# EAGLE design Controller_low_power_v1.0 (EAGLE 9.3.0)

## Sheet 1 of 2
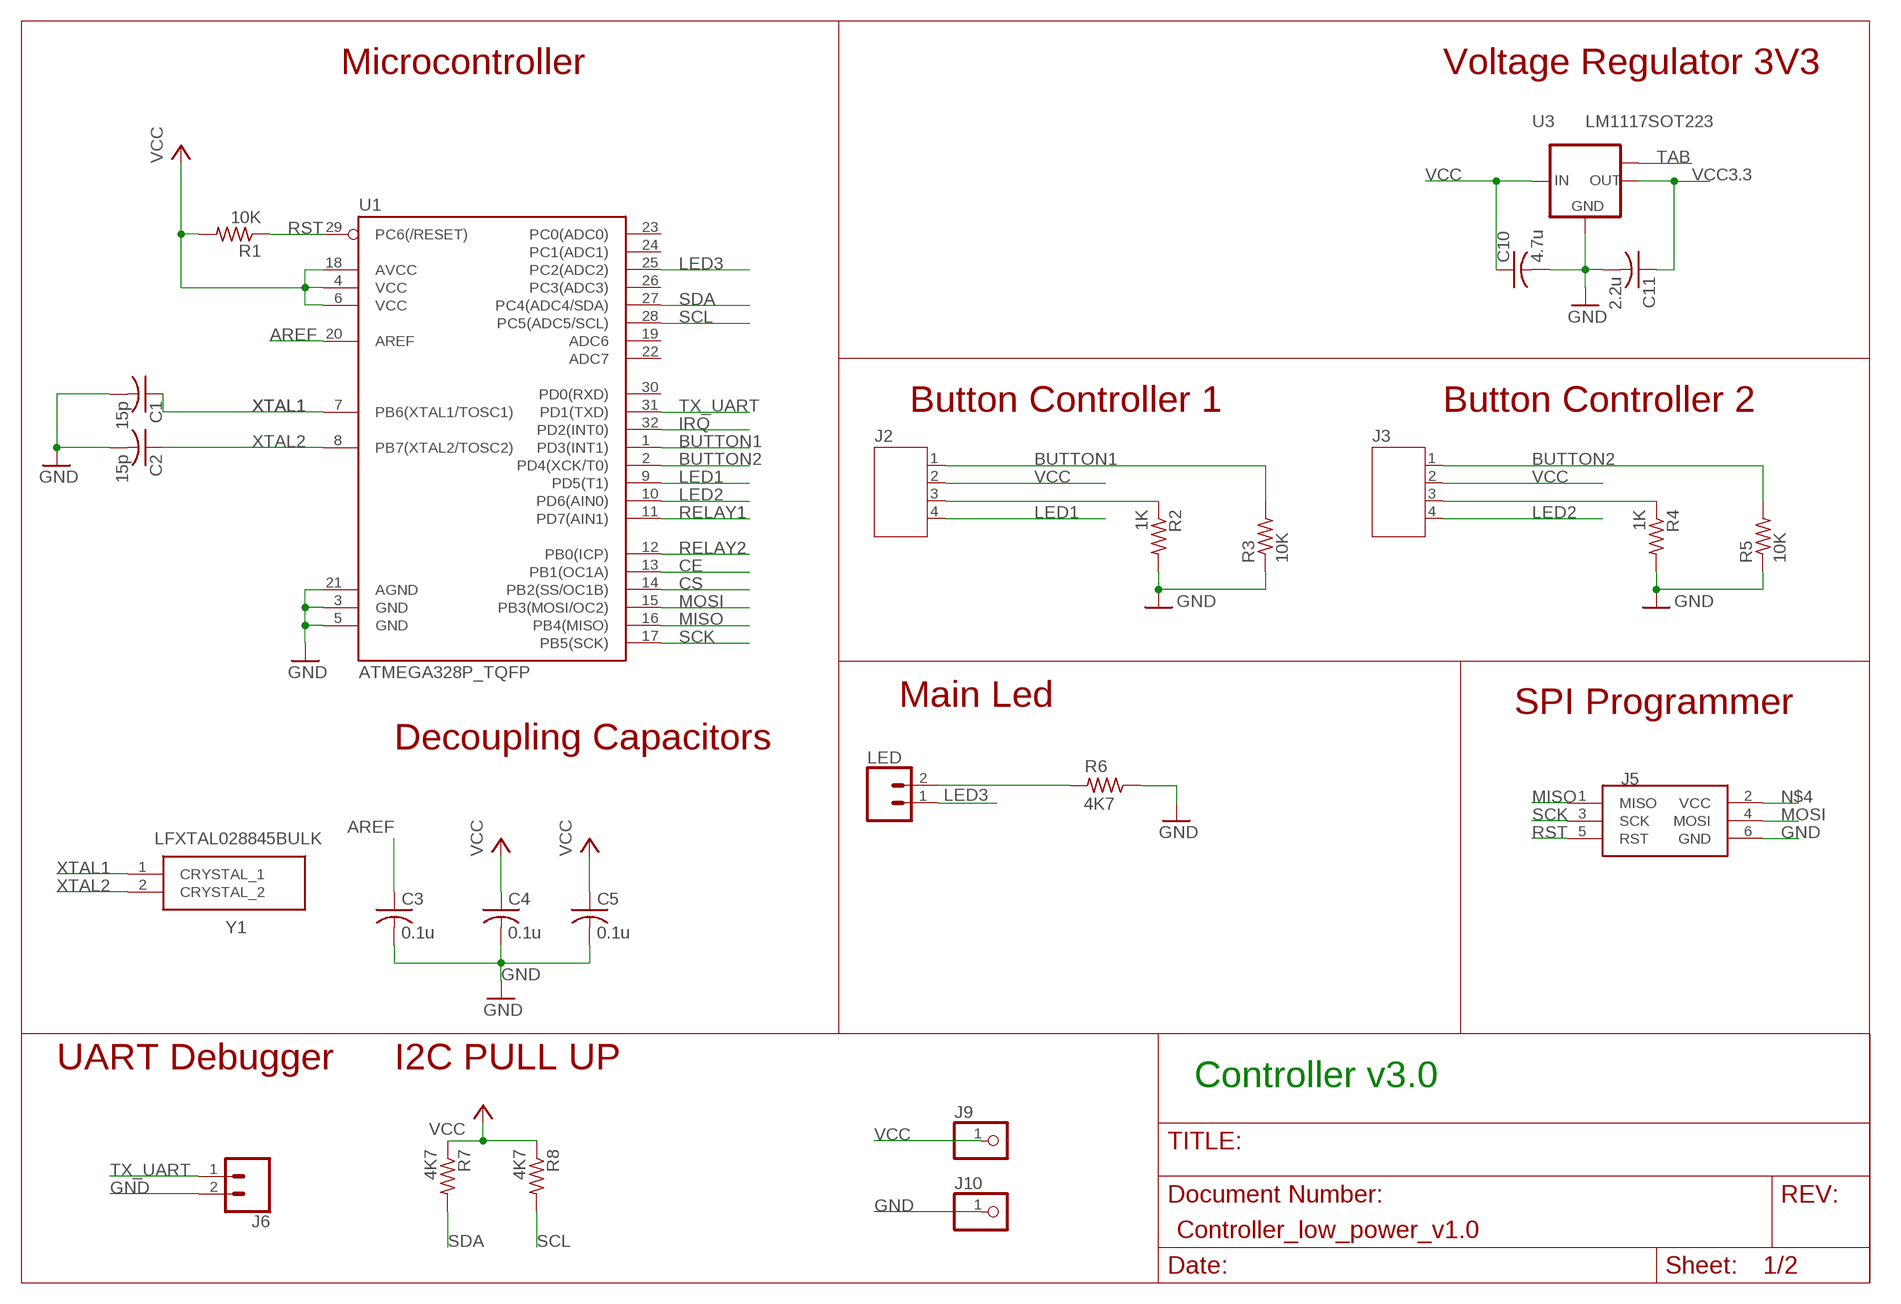
[diagram p0: schematic, sheet 1]

### Parts
C1  15p  CAPACITOR-SMD-0805  [SMD-0805]
C2  15p  CAPACITOR-SMD-0805  [SMD-0805]
C3  0.1u  CAPACITOR-SMD-0805  [SMD-0805]
C4  0.1u  CAPACITOR-SMD-0805  [SMD-0805]
C5  0.1u  CAPACITOR-SMD-0805  [SMD-0805]
C10  4.7u  CAPACITOR-SMD-0805  [SMD-0805]
C11  2.2u  CAPACITOR-SMD-0805  [SMD-0805]
J2  JST-PH4  [JST-PH4]
J3  JST-PH4  [JST-PH4]
J5  ISP  AVRISP-6  [AVRISP]
J6  CONN_02  [1X02]
J9  PINHD-1X1CB  [1X01-CLEANBIG]
J10  PINHD-1X1CB  [1X01-CLEANBIG]
LED  CONN_02  [1X02]
R1  10K  RESISTOR-SMD-0805  [SMD-0805]
R2  1K  RESISTOR-SMD-0805  [SMD-0805]
R3  10K  RESISTOR-SMD-0805  [SMD-0805]
R4  1K  RESISTOR-SMD-0805  [SMD-0805]
R5  10K  RESISTOR-SMD-0805  [SMD-0805]
R6  4K7  RESISTOR-SMD-0805  [SMD-0805]
R7  4K7  RESISTOR-SMD-0805  [SMD-0805]
R8  4K7  RESISTOR-SMD-0805  [SMD-0805]
U1  ATMEGA328P_TQFP  [TQFP32-08]
U3  LM1117SOT223  LM1117MPX-3.3  [SOT223]
Y1  LFXTAL028845BULK  [LFXTAL028845BULK]

### Nets
AREF: C3.1 U1.20(AREF)
BUTTON1: J2.1 R3.2 U1.1(PD3(INT1))
BUTTON2: J3.1 R5.2 U1.2(PD4(XCK/T0))
CE: U1.13(PB1(OC1A)) ; also sheet 2
CS: U1.14(PB2(SS/OC1B)) ; also sheet 2
GND: C1.2 C2.2 C3.2 C4.2 C5.2 C10.2 C11.2 J5.6(GND) J6.2 J10.1 R2.2 R3.1 R4.2 R5.1 R6.1 U1.3(GND) U1.5(GND) U1.21(AGND) U3.1(GND) ; also sheet 2
IRQ: U1.32(PD2(INT0)) ; also sheet 2
LED1: J2.4 U1.9(PD5(T1))
LED2: J3.4 U1.10(PD6(AIN0))
LED3: LED.1 U1.25(PC2(ADC2))
MISO: J5.1(MISO) U1.16(PB4(MISO)) ; also sheet 2
MOSI: J5.4(MOSI) U1.15(PB3(MOSI/OC2)) ; also sheet 2
N$4: J5.2(VCC)
N$8: LED.2 R6.2
N$9: J2.3 R2.1
N$11: J3.3 R4.1
RELAY1: U1.11(PD7(AIN1)) ; also sheet 2
RELAY2: U1.12(PB0(ICP)) ; also sheet 2
RST: J5.5(RST) R1.1 U1.29(PC6(/RESET))
SCK: J5.3(SCK) U1.17(PB5(SCK)) ; also sheet 2
SCL: R8.2 U1.28(PC5(ADC5/SCL)) ; also sheet 2
SDA: R7.2 U1.27(PC4(ADC4/SDA)) ; also sheet 2
TAB: U3.TAB(OUT1)
TX_UART: J6.1 U1.31(PD1(TXD))
VCC: C4.1 C5.1 C10.1 J2.2 J3.2 J9.1 R1.2 R7.1 R8.1 U1.4(VCC) U1.6(VCC) U1.18(AVCC) U3.3(IN) ; also sheet 2
VCC3.3: C11.1 U3.2(OUT) ; also sheet 2
XTAL1: C1.1 U1.7(PB6(XTAL1/TOSC1)) Y1.1(CRYSTAL_1)
XTAL2: C2.1 U1.8(PB7(XTAL2/TOSC2)) Y1.2(CRYSTAL_2)
Unconnected: U1.19(ADC6) U1.22(ADC7) U1.23(PC0(ADC0)) U1.24(PC1(ADC1)) U1.26(PC3(ADC3)) U1.30(PD0(RXD))

### Notes on the sheet
- Microcontroller | Voltage Regulator 3V3
- Button Controller 1 | Button Controller 2
- Main Led | SPI Programmer
- Decoupling Capacitors
- UART Debugger | I2C PULL UP
- Controller v3.0

## Sheet 2 of 2
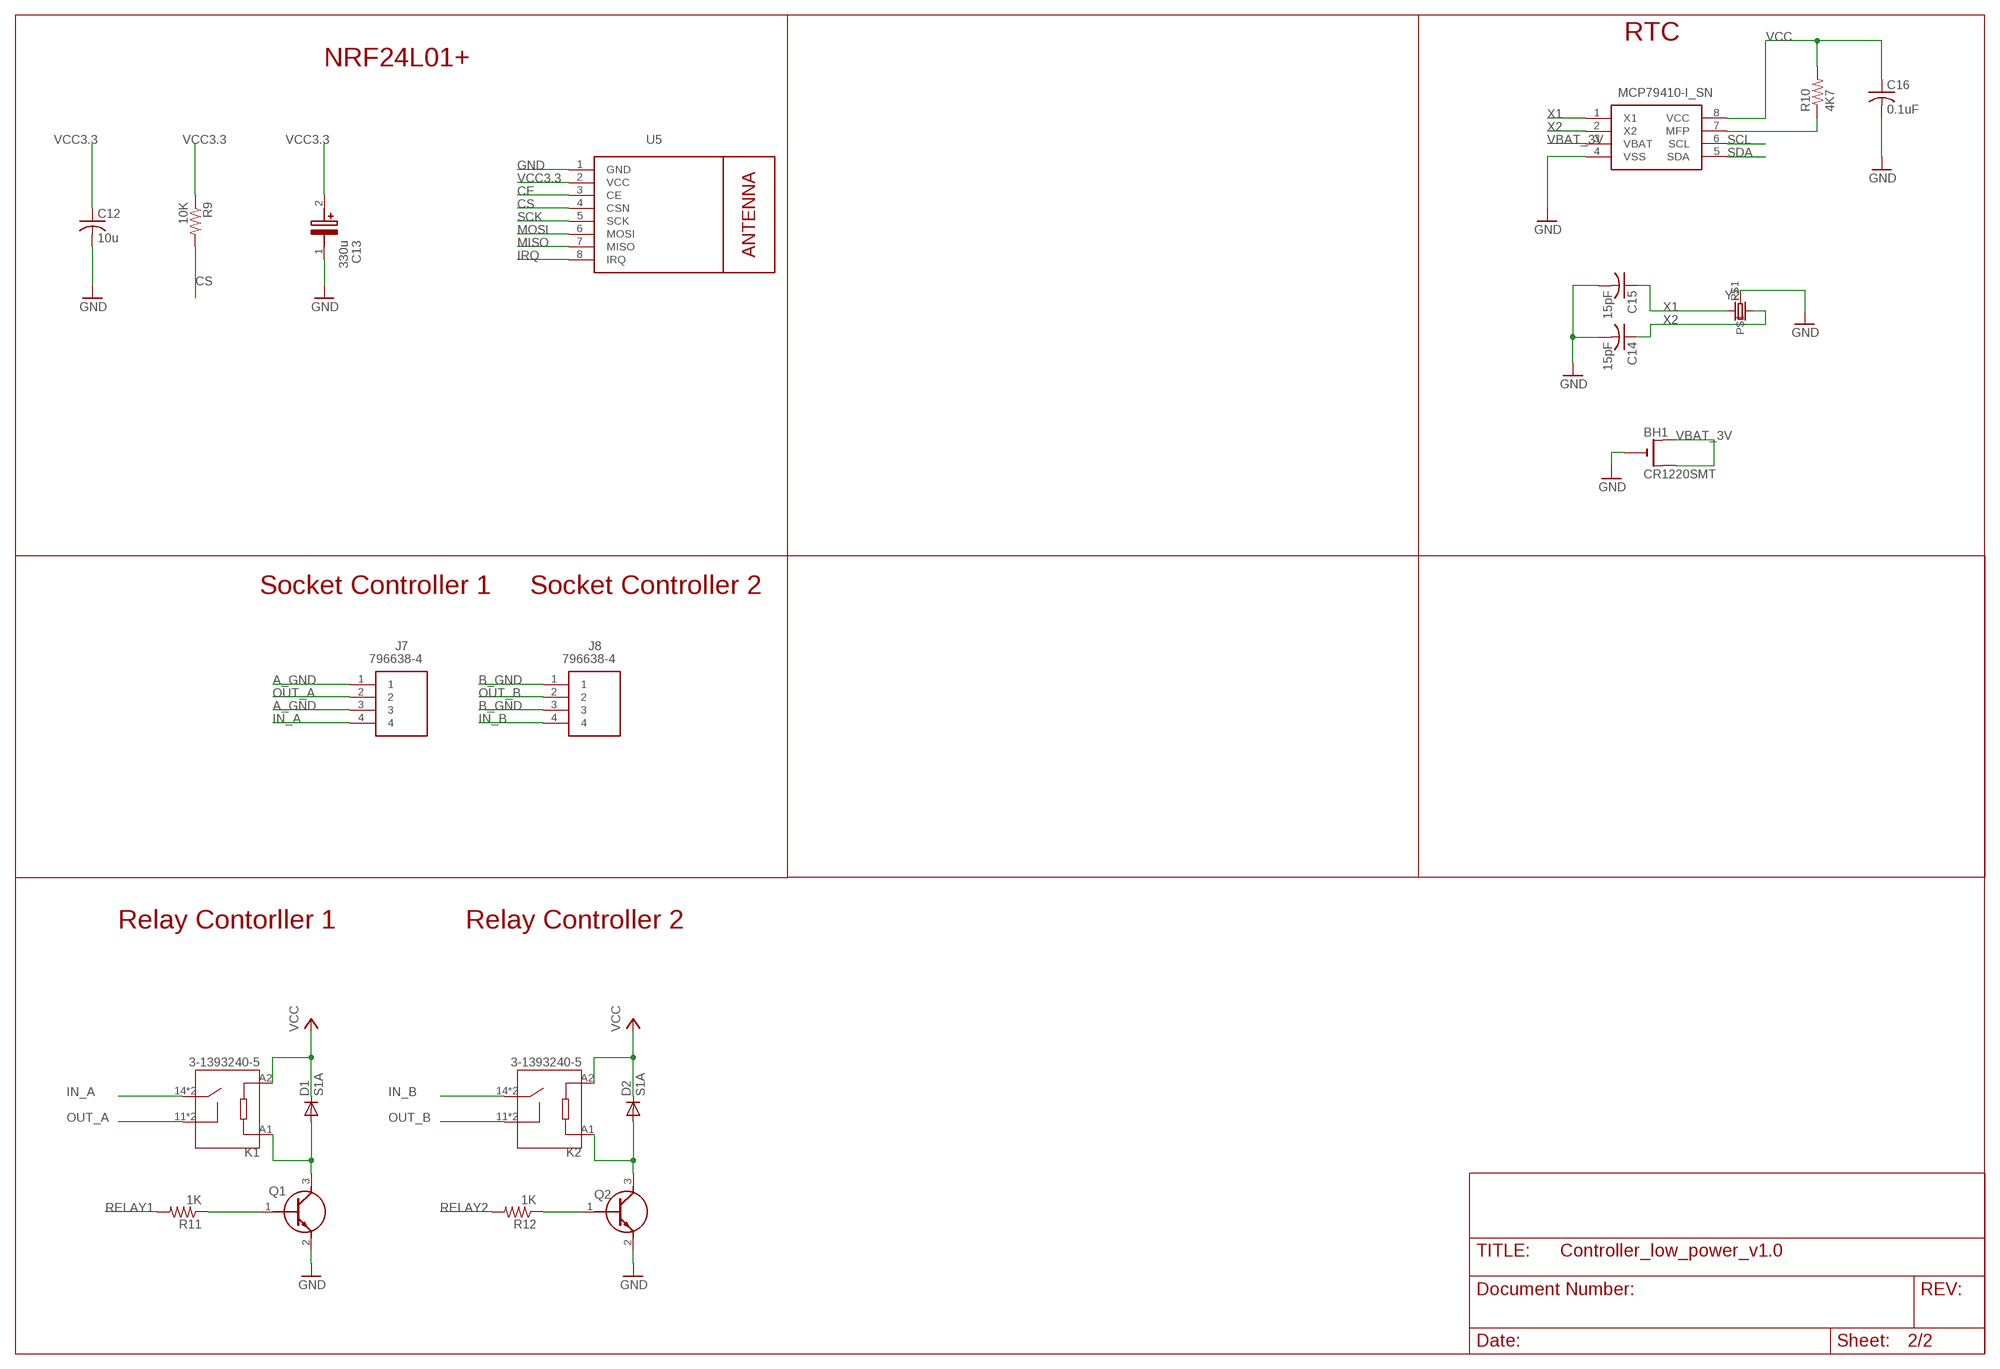
[diagram p1: schematic, sheet 2]

### Parts
BH1  CR1220SMT  [CR1220-SMD]
C12  10u  CAPACITOR-SMD-0805  [SMD-0805]
C13  330u  EEE-FNC271XUP  [SMD_LYTIC_D8]
C14  15pF  CAPACITOR-SMD-0805  [SMD-0805]
C15  15pF  CAPACITOR-SMD-0805  [SMD-0805]
C16  0.1uF  CAPACITOR-SMD-0805  [SMD-0805]
D1  S1A  [DO214AC]
D2  S1A  [DO214AC]
J7  796638-4  [SHDRRA4W102P0X508_1X4_2214X120]
J8  796638-4  [SHDRRA4W102P0X508_1X4_2214X120]
K1  3-1393240-5  [TE_3-1393240-5]
K2  3-1393240-5  [TE_3-1393240-5]
Q1  MMBT2222A-TP  [SI2305TP]
Q2  MMBT2222A-TP  [SI2305TP]
R9  10K  RESISTOR-SMD-0805  [SMD-0805]
R10  4K7  RESISTOR-SMD-0805  [SMD-0805]
R11  1K  RESISTOR-SMD-0805  [SMD-0805]
R12  1K  RESISTOR-SMD-0805  [SMD-0805]
U5  WIRELESS-NRF24L01  [WIRELESS-NRF24L01]
U6  MCP79410-I_SN  [SOIC127P600X175-8N]
Y2  CRYSTALTC26H  [TC26H]

### Nets
A_GND: J7.1 J7.3
B_GND: J8.1 J8.3
CE: U5.3(CE) ; also sheet 1
CS: R9.2 U5.4(CSN) ; also sheet 1
GND: BH1.- C12.2 C13.1 C14.2 C15.2 C16.2 Q1.2(E) Q2.2(E) U5.1(GND) U6.4(VSS) Y2.P$1 ; also sheet 1
IN_A: J7.4 K1.14 K1.14-1
IN_B: J8.4 K2.14 K2.14-1
IRQ: U5.8(IRQ) ; also sheet 1
MISO: U5.7(MISO) ; also sheet 1
MOSI: U5.6(MOSI) ; also sheet 1
N$1: Q2.1(B) R12.1
N$2: D2.A K2.A1 Q2.3(C)
N$3: D1.A K1.A1 Q1.3(C)
N$6: Q1.1(B) R11.1
N$16: R10.1 U6.7(MFP)
OUT_A: J7.2 K1.11 K1.11-1
OUT_B: J8.2 K2.11 K2.11-1
RELAY1: R11.2 ; also sheet 1
RELAY2: R12.2 ; also sheet 1
SCK: U5.5(SCK) ; also sheet 1
SCL: U6.6(SCL) ; also sheet 1
SDA: U6.5(SDA) ; also sheet 1
VBAT_3V: BH1.+$1(+) BH1.+$2(+1) U6.3(VBAT)
VCC: C16.1 D1.C D2.C K1.A2 K2.A2 R10.2 U6.8(VCC) ; also sheet 1
VCC3.3: C12.1 C13.2 R9.1 U5.2(VCC) ; also sheet 1
X1: C15.1 U6.1(X1) Y2.2
X2: C14.1 U6.2(X2) Y2.1

### Notes on the sheet
- RTC
- NRF24L01+
- Socket Controller 1 | Socket Controller 2
- Relay Contorller 1 | Relay Controller 2

## Library data of the parts
BH1 = CR1220:CR1220: CR1216/CR1220/CR1225 12mm 3V lithium coin cell Great for battery packup. Both SMT and THM holders. Note the THM package has the ground pads on both sides of the PCB so that the masks are the same - this reduces the cost Check prices <https://pricing.snapeda.com/parts/CR1220/FDK%20America%2C/view-part?ref=eda>; AVAILABILITY: In Stock; DESCRIPTION: Button cell battery, Lithium, 3 V, 35 mAh | VARTA CR1220 (Button cell battery, Lithium, 3 V, 35 mAh Standard Batteries).; MF: FDK America,; MP: CR1220; PACKAGE: Varta; PRICE: None
C1-C5 C10-C12 C14-C16 = Fuzzy:CAPACITOR-SMD-0805
C13 = SamacSys_Parts:EEE-FNC271XUP: PANASONIC - EEE-FNC271XUP - CAP, 270UF, 16V, ALU ELEC, SMD Source: Datasheet <http://industrial.panasonic.com/cdbs/www-data/pdf/RDE0000/RDE0000C1259.pdf>; DESCRIPTION: PANASONIC - EEE-FNC271XUP - CAP, 270UF, 16V, ALU ELEC, SMD; HEIGHT: 7.8mm; MANUFACTURER_NAME: Panasonic; MANUFACTURER_PART_NUMBER: EEE-FNC271XUP; MOUSER_PART_NUMBER: 667-EEE-FNC271XUP; MOUSER_PRICE-STOCK: https://www.mouser.co.uk/ProductDetail/Panasonic/EEE-FNC271XUP?qs=OlC7AqGiEDk4Wtbs6TVCqQ%3D%3D
D1 D2 = s1x_10:S1*: S1A - S1M General Purpose Rectifiers Source: http://www.fairchildsemi.com/datasheets/S1/S1A.pdf; MF: Fairchild; MPN: S1A; OC_FARNELL: 9843868; OC_NEWARK: 58K9551
J2 J3 = jst-ph:JST-PH4
J5 = adafruit:AVRISP: AVR ISP HEADER Standard 6 pin header for AVR programming
J6 LED = SparkFun-Connectors:CONN_02: Multi connection point. Often used as Generic Header-pin footprint for 0.1 inch spaced/style header connections On any of the 0.1 inch spaced packages, you can populate with these: Break Away Headers - Straight <https://www.sparkfun.com/products/116> (PRT-00116) Break Away Male Headers - Right Angle <https://www.sparkfun.com/products/553> (PRT-00553) Female Headers <https://www.sparkfun.com/products/115> (PRT-00115) Break Away Headers - Machine Pin <https://www.sparkfun.com/products/117> (PRT-00117) Break Away Female Headers - Swiss Machine Pin <https://www.sparkfun.com/products/743> (PRT-00743) For SCREWTERMINALS and SPRING TERMINALS visit here: Screw Terimnals on SparkFun.com <https://www.sparkfun.com/search/results?term=Screw+Terminals> (5mm/3.5mm/2.54mm spacing) This device is also useful as a general connection point to wire up your design to another part of your project. Our various solder wires solder well into these plated through hole pads. Hook-Up Wire - Assortment (Stranded, 22 AWG) <https://www.sparkfun.com/products/11375> (PRT-11375) Hook-Up Wire - Assortment (Solid Core, 22 AWG) <https://www.sparkfun.com/products/11367> (PRT-11367) View the entire wire category on our website here <https://www.sparkfun.com/categories/141> Special notes: Molex polarized connector foot print use with: PRT-08233 with associated crimp pins and housings. 2.54_SCREWTERM for use with PRT-10571. 3.5mm Screw Terminal footprints for PRT-08084 5mm Screw Terminal footprints for use with PRT-08432
J7 J8 = SamacSys_Parts:796638-4: Termi-Block Header 4 way pcb r/a Source: Datasheet <https://www.te.com/commerce/DocumentDelivery/DDEController?Action=srchrtrv&DocNm=796638&DocType=Customer Drawing&DocLang=English>; DESCRIPTION: Termi-Block Header 4 way pcb r/a; HEIGHT: 8.5mm; MANUFACTURER_NAME: TE Connectivity; MANUFACTURER_PART_NUMBER: 796638-4; MOUSER_PART_NUMBER: 571-7966384; MOUSER_PRICE-STOCK: https://www.mouser.co.uk/ProductDetail/TE-Connectivity/796638-4?qs=OgP1KchuM4NiWRtHX9POHQ%3D%3D
J9 J10 = adafruit:PINHD-1X1: Pin header 1x1 for 0.1" spacing With round pins
K1 K2 = 3-1393240-5:3-1393240-5: Electromechanical Relay 24VDC 1.44KOhm 16A SPST-NO (29x12.7x15.7)mm THT Power Relay; AVAILABILITY: Unavailable; COMMENT: 3-1393240-5; DESCRIPTION: Electromechanical Relay 24VDC 1.44KOhm 16A SPST-NO _29x12.7x15.7_mm THT Power Relay; MF: TE Connectivity; MP: 3-1393240-5; PACKAGE: None; PRICE: None; TE_PURCHASE_URL: https://www.te.com/usa-en/product-3-1393240-5.html?te_bu=Cor&te_type=disp&te_campaign=seda_glo_cor-seda-global-disp-prtnr-fy19-seda-model-bom-cta_sma-317_1&elqCampaignId=32493
Q1 Q2 = SamacSys_Parts:MMBT2222A-TP: MICRO COMMERCIAL COMPONENTS - MMBT2222A-TP - BJT, NPN, 40VDC, SOT-23 Source: Datasheet <https://datasheet.datasheetarchive.com/originals/distributors/Datasheets_SAMA/282e04cdf1a526471339103510be6d53.pdf>; DESCRIPTION: MICRO COMMERCIAL COMPONENTS - MMBT2222A-TP - BJT, NPN, 40VDC, SOT-23; HEIGHT: mm; MANUFACTURER_NAME: Micro Commercial Components (MCC); MANUFACTURER_PART_NUMBER: MMBT2222A-TP; MOUSER_PART_NUMBER: 833-MMBT2222A-TP; MOUSER_PRICE-STOCK: https://www.mouser.co.uk/ProductDetail/Micro-Commercial-Components-MCC/MMBT2222A-TP?qs=KFo7JewZbUE%252BJc5W0eD55w%3D%3D
R1-R12 = Fuzzy:RESISTOR-SMD-0805
U1 = SparkFun-IC-Microcontroller:ATMEGA328P_TQFP: Popular 328P in QFP Storefront component: ATmega328 - TQFP <https://www.sparkfun.com/products/13448> (COM-13448) Datasheet <http://www.sparkfun.com/datasheets/Components/SMD/ATMega328.pdf> SparkFun Products SparkFun RedBoard - Programmed with Arduino <https://www.sparkfun.com/products/12757> (DEV-12757) Arduino Pro Mini 328 - 5V/16MHz <https://www.sparkfun.com/products/11113> (DEV-11113) Arduino Pro Mini 328 - 3.3V/8MHz <https://www.sparkfun.com/products/11114> (DEV-11114) SparkFun OpenLog <https://www.sparkfun.com/products/13712> (DEV-13712) SparkFun MicroView - OLED Arduino Module <https://www.sparkfun.com/products/12923> (DEV-12923) SparkFun Digital Sandbox <https://www.sparkfun.com/products/12651> (DEV-12651) SparkFun PicoBoard <https://www.sparkfun.com/products/11888> (WIG-11888) Arduino Fio <https://www.sparkfun.com/products/10116> (DEV-10116) LilyPad Arduino 328 Main Board <https://www.sparkfun.com/products/13342> (DEV-13342) SparkFun RedStick <https://www.sparkfun.com/products/13741> (DEV-13741) LilyPad MP3 <https://www.sparkfun.com/products/11013> (DEV-11013) LilyPad Arduino SimpleSnap <https://www.sparkfun.com/products/10941> (DEV-10941) SparkFun Stepoko <https://www.sparkfun.com/products/13899> (ROB-13899) SparkFun Geiger Counter <https://www.sparkfun.com/products/11345> (SEN-11345) SparkFun EL Sequencer <https://www.sparkfun.com/products/12781> (COM-12781) Arduino Pro 328 - 5V/16MHz <https://www.sparkfun.com/products/10915> (DEV-10915) CryptoCape <https://www.sparkfun.com/products/12773> (DEV-12773) SparkFun IR Thermometer Evaluation Board - MLX90614 <https://www.sparkfun.com/products/10740> (SEN-10740) SparkFun RedBot Mainboard <https://www.sparkfun.com/products/12097> (ROB-12097) Arduino Pro 328 - 3.3V/8MHz <https://www.sparkfun.com/products/10914> (DEV-10914) SparkFun Block for Intel® Edison - Arduino <https://www.sparkfun.com/products/13036> (DEV-13036) SparkFun Simon Says - Surface Mount Soldering Kit <https://www.sparkfun.com/products/10935> (KIT-10935) SparkFun 7-Segment Serial Display - Red <https://www.sparkfun.com/products/11441> (COM-11441) SparkFun 7-Segment Serial Display - White <https://www.sparkfun.com/products/11629> (COM-11629) SparkFun 7-Segment Serial Display - Yellow <https://www.sparkfun.com/products/11443> (COM-11443) SparkFun 7-Segment Serial Display - Kelly Green <https://www.sparkfun.com/products/11440> (COM-11440) SparkFun 7-Segment Serial Display - Blue <https://www.sparkfun.com/products/11442> (COM-11442) SparkFun OpenSegment Serial Display - 20mm (Blue) <https://www.sparkfun.com/products/11647> (COM-11647) SparkFun OpenSegment Serial Display - 20mm (Green) <https://www.sparkfun.com/products/11646> (COM-11646) SparkFun OpenSegment Serial Display - 20mm (White) <https://www.sparkfun.com/products/11648> (COM-11648) SparkFun OpenSegment Serial Display - 20mm (Red) <https://www.sparkfun.com/products/11644> (COM-11644) SparkFun OpenSegment Serial Display - 20mm (Yellow) <https://www.sparkfun.com/products/11645> (COM-11645) SparkFun OpenSegment Shield <https://www.sparkfun.com/products/13190> (DEV-13190); PROD_ID: IC-09069
U3 = lm1117:LM1117MPX-*
U5 = diy-modules:WIRELESS-NRF24L01: 2.4 GHz Wireless Module based on NRF24L01 chip More details available here: http://www.electrodragon.com/w/NRF24L01 Click here to find device on ebay.com <http://www.ebay.com/sch/nrf24l01+arduino>
U6 = SamacSys_Parts:MCP79410-I_SN: I2C GP RTCC, 1Kb EE, 64B SRAM, ID Source: Datasheet <https://componentsearchengine.com/Datasheets/1/MCP79410-I_SN.pdf>; DESCRIPTION: I2C GP RTCC, 1Kb EE, 64B SRAM, ID; HEIGHT: 1.75mm; MANUFACTURER_NAME: Microchip; MANUFACTURER_PART_NUMBER: MCP79410-I/SN; MOUSER_PART_NUMBER: 579-MCP79410-I/SN; MOUSER_PRICE-STOCK: https://www.mouser.com/Search/Refine.aspx?Keyword=579-MCP79410-I%2FSN
Y1 = SamacSys_Parts:LFXTAL028845BULK: Crystals 4MHz 12pF -20C 70C Source: Datasheet; DESCRIPTION: Crystals 4MHz 12pF -20C 70C; HEIGHT: 4.3mm; MANUFACTURER_NAME: IQD; MANUFACTURER_PART_NUMBER: LFXTAL028845BULK
Y2 = adafruit:CRYSTAL: CRYSTAL; OC_FARNELL: unknown; OC_NEWARK: unknown

## Net classes
0 default: width 0.254 mm, drill 0.508 mm, clearance 0.203 mm
1 ACnet: width 1.778 mm, drill 0.508 mm, clearance 0.203 mm

## Board
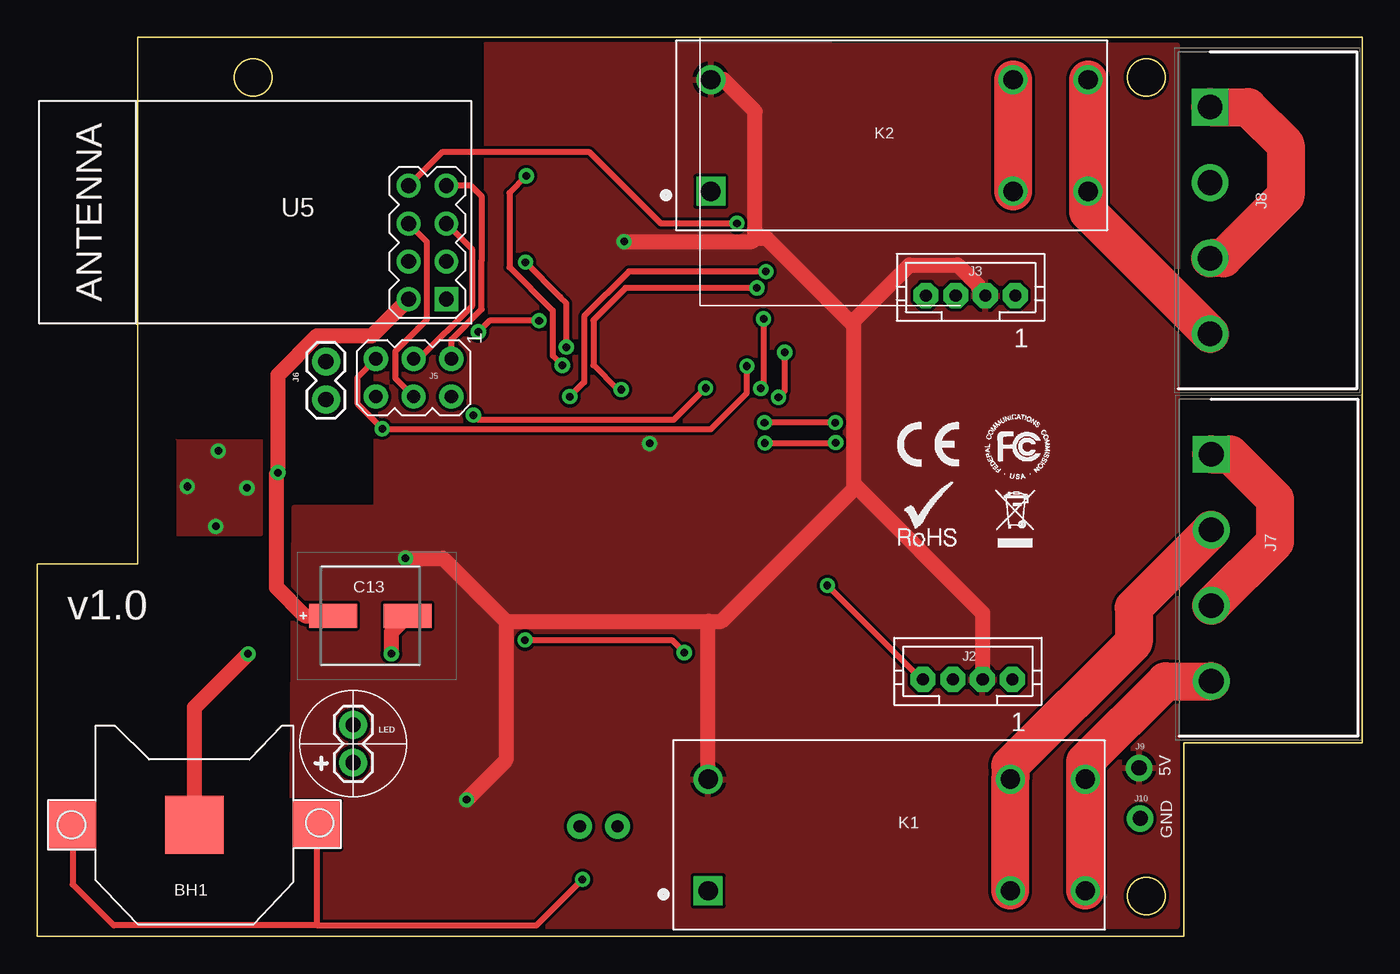
[diagram p2: board, top side]
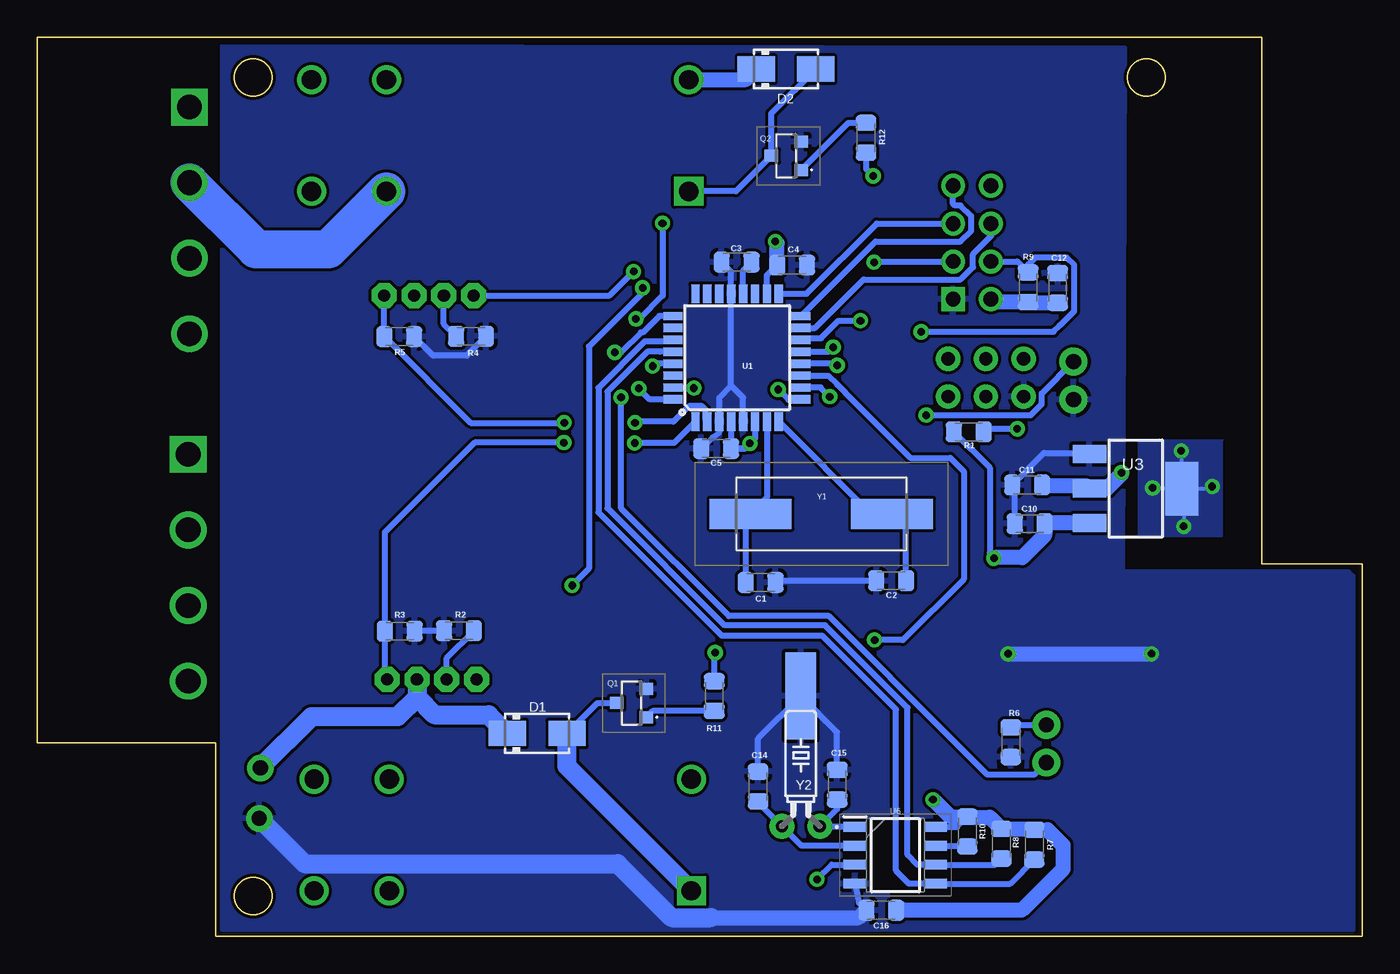
[diagram p3: board, bottom side, seen from below]

Size 89 x 60.4 mm. Coordinates in mm from the lower left corner, seen from the top.
Outline: 0,0 77,0 77,13 89,13 89,60.4 6.75,60.4 6.75,25 0,25 0,0
Outline: circle at 74.5,57.7 radius 1.25
Outline: circle at 74.5,2.7 radius 1.25
Outline: circle at 14.5,57.7 radius 1.25
Copper layers (1*16): Top 0.035mm / dielectric 1.5mm / Bottom 0.035mm
Design rules "SparkFun": minimum track width 8mil, minimum drill 20mil, track to track 8mil, track to pad 8mil, pad to pad 8mil, via to via 8mil, smd to smd 8mil, copper to edge 8mil, drill to drill 8mil, minimum pad ring 12mil, minimum via ring 10mil, stop-mask expansion 4mil, vias tented up to drill 20mil, thermal gap 10mil

### Footprints (pad centres in the part's own frame; a part is rotated, then mirrored left to right if it is on the bottom)
CR1220-SMD = smd 3.2 x 3.2: +$1 -8.2,0; +$2 8.2,0 | smd 3.9 x 3.9: - 0,0
SMD-0805 = smd 1.1 x 1.4: 1 -1,0; 2 1,0
SMD_LYTIC_D8 = smd 3.2 x 1.6: 1 -2.5,0; 2 2.5,0
DO214AC = smd 2.5 x 1.7: A 2,0; C -2,0
JST-PH4 = drill 0.813 pad 1.676 octagon: 1 3,0; 2 1,0; 3 -1,0; 4 -3,0
AVRISP = drill 0.9 pad 1.626: 1 -1.27,2.54; 2 1.27,2.54; 3 -1.27,0; 4 1.27,0; 5 -1.27,-2.54; 6 1.27,-2.54
1X02 = drill 1.016 pad 1.88: 1 0,0; 2 2.54,0
SHDRRA4W102P0X508_1X4_2214X120 = drill 1.65 pad 2.475 square: 1 0,0 | drill 1.65 pad 2.475: 2 5.08,0; 3 10.16,0; 4 15.24,0
1X01-CLEANBIG = drill 1.016 pad 1.778: 1 0,0
TE_3-1393240-5 = drill 1.3: 11 20.3,-3.75; 11-1 20.3,3.75; 14 25.34,-3.75; 14-1 25.34,3.75; A2 0,3.75 | drill 1.3 square: A1 0,-3.75
SI2305TP = smd 0.8 x 0.9: 1 -0.95,-1; 2 0.95,-1; 3 0,1
TQFP32-08 = smd 1.27 x 0.559: 1 -4.293,2.8; 2 -4.293,2; 3 -4.293,1.2; 4 -4.293,0.4; 5 -4.293,-0.4; 6 -4.293,-1.2; 7 -4.293,-2; 8 -4.293,-2.8; 17 4.293,-2.8; 18 4.293,-2; 19 4.293,-1.2; 20 4.293,-0.4; 21 4.293,0.4; 22 4.293,1.2; 23 4.293,2; 24 4.293,2.8 | smd 0.559 x 1.27: 9 -2.8,-4.293; 10 -2,-4.293; 11 -1.2,-4.293; 12 -0.4,-4.293; 13 0.4,-4.293; 14 1.2,-4.293; 15 2,-4.293; 16 2.8,-4.293; 25 2.8,4.293; 26 2,4.293; 27 1.2,4.293; 28 0.4,4.293; 29 -0.4,4.293; 30 -1.2,4.293; 31 -2,4.293; 32 -2.8,4.293
SOT223 = smd 1.219 x 2.235: 1 -2.311,-3.099; 2 0,-3.099; 3 2.311,-3.099 | smd 3.6 x 2.2: TAB 0,3.099
WIRELESS-NRF24L01 = drill 1 square: 1 -12.7,6.35 | drill 1: 2 -10.16,6.35; 3 -12.7,3.81; 4 -10.16,3.81; 5 -12.7,1.27; 6 -10.16,1.27; 7 -12.7,-1.27; 8 -10.16,-1.27
SOIC127P600X175-8N = smd 1.525 x 0.65: 1 -2.712,1.905; 2 -2.712,0.635; 3 -2.712,-0.635; 4 -2.712,-1.905; 5 2.712,-1.905; 6 2.712,-0.635; 7 2.712,0.635; 8 2.712,1.905
LFXTAL028845BULK = smd 5.5 x 2: 1 -4.75,0; 2 4.75,0
TC26H = drill 0.813 pad 1.676: 1 -1.27,0; 2 1.27,0 | smd 2.032 x 5.842: P$1 0,8.763

### Placement (x,y rotation side)
BH1  10.56,7.48 0 top
C1  40.41,23.77 0 bottom
C2  31.64,23.89 180 bottom
C3  42.03,45.29 180 bottom
C4  38.3,45.1 0 bottom
C5  43.4,32.76 180 bottom
C10  22.33,27.72 180 bottom
C11  22.51,30.33 180 bottom
C12  20.46,43.55 90 bottom
C13  22.38,21.53 180 top
C14  40.58,10.07 90 bottom
C15  35.27,10.18 90 bottom
C16  32.31,1.75 180 bottom
D1  55.42,13.63 0 bottom
D2  38.71,58.26 0 bottom
J2  62.5,17.26 0 top
J3  62.69,43.05 0 top
J5  25.28,37.53 270 top
J6  19.39,38.6 270 top
J7  78.86,32.38 270 top
J8  78.78,55.71 270 top
J9  74.01,11.31 0 top
J10  74.09,7.92 0 top
K1  45.06,6.81 0 top
K2  45.24,53.8 0 top
LED  21.23,11.67 90 top
Q1  49.08,15.67 90 bottom
Q2  38.69,52.43 90 bottom
R1  26.43,33.89 180 bottom
R2  60.67,20.53 180 bottom
R3  64.65,20.5 180 bottom
R4  59.86,40.31 0 bottom
R5  64.68,40.29 180 bottom
R6  23.61,13.04 90 bottom
R7  22.03,6.16 270 bottom
R8  24.24,6.22 270 bottom
R9  22.44,43.61 90 bottom
R10  26.53,7.04 90 bottom
R11  43.53,16.14 90 bottom
R12  33.33,53.65 270 bottom
U1  41.99,38.87 90 bottom
U3  15.22,30.08 270 bottom
U5  14.78,49.15 180 top
U6  31.36,5.45 0 bottom
Y1  36.33,28.38 0 bottom
Y2  37.71,7.39 0 bottom

### Tracks (layer width: path | path; a pad name or v marks a point on that pad's centre or on a via)
A_GND
  Top 2.54: J7.1 80.12,32.38 83.15,29.35 83.15,26.5 J7.3
AREF
  Bottom 0.406: U1.20 41.59,44.73 C3.1
B_GND
  Top 2.54: J8.1 81.32,55.71 83.86,53.17 83.86,49.74 79.67,45.55 J8.3
BUTTON1  (via drill 0.51)
  Top 0.406: v48.87,33.14 53.6,33.14 v53.63,33.17
  Bottom 0.406: v48.87,33.14 46.23,33.14 U1.1 | v53.63,33.17 59.61,33.17 65.65,27.13 R3.2 65.65,17.41 J2.1
BUTTON2  (via drill 0.51)
  Top 0.406: v53.61,34.51 v48.85,34.51
  Bottom 0.406: U1.2 44.1,34.69 44.1,35.38 44.34,35.62 45.24,35.62 46.28,34.58 48.78,34.58 v48.85,34.51 | v53.61,34.51 53.63,34.49 59.88,34.49 R5.2 J3.1
CE  (via drill 0.51)
  Top 0.406: v35.54,39.58 35.54,42.53 35.13,42.94 v32.79,45.28
  Bottom 0.406: U1.13 35.85,39.27 v35.54,39.58 | v32.79,45.28 32.73,45.34 U5.3
CS  (via drill 0.51)
  Top 0.406: v33.71,41.36 30.38,41.36 v29.63,40.61
  Bottom 0.406: U1.14 37.58,40.18 36.36,40.18 35.18,41.36 v33.71,41.36 | U5.4 23.17,45.34 R9.2 22.44,45.14 21.97,45.61 19.86,45.61 19.35,45.11 19.35,41.99 20.24,41.11 20.32,41.03 20.74,40.61 v29.63,40.61
GND  (via drill 0.51)
  Top 1.016: v23.79,18.98 23.79,20.44 C13.1 | BH1.- 10.56,15.38 v14.16,18.98
  Bottom 0.406: C3.2 42.39,44.65 U1.21 42.39,36.99 | C5.2 43.62,33.54 43.54,33.54 43.19,33.89 U1.3 43.19,36.19 42.39,36.99 | C2.2 39.29,23.89 C1.2 | U6.4 33.82,2.26 C16.2 | R4.2 60.16,39.01 62.4,39.01 R5.1 | R2.2 61.7,20.5 R3.1 | U1.5 41.59,36.19 42.39,36.99 | C10.2 23.33,30.15 C11.2 21.37,32.47 18.4,32.47 U3.1 | C14.2 40.58,13.28 Y2.P$1 35.27,13.71 C15.2
  Bottom 1.016: v23.79,18.98 v14.16,18.98 | 43.74,1.25 33.81,1.25 C16.2
  Bottom 1.27: J10.1 71.04,4.87 50.01,4.87 46.38,1.25 43.74,1.25
  pour Bottom: 15.97,59.63 76.55,59.73 76.55,0.5 0.63,0.5 0.63,24.16 0.93,24.46 16.1,24.46
IN_A
  Top 2.54: K1.14 K1.14-1 70.4,11.75 75.79,17.14 J7.4
IN_B
  Top 2.54: K2.14-1 K2.14 70.58,48.67 J8.4
IRQ  (via drill 0.51)
  Top 0.406: v48.79,41.48 48.79,37 v48.6,36.81 | U5.8 27.23,52.71 37.06,52.71 41.87,47.9 v47,47.9
  Bottom 0.406: U1.32 47.86,36.07 v48.6,36.81 | v48.79,41.48 48.55,41.48 47,43.03 v47,47.9
LED1  (via drill 0.51)
  Top 0.406: v48.34,43.56 39.51,43.56 37.35,41.4 37.35,38.37 38.99,36.73 v39.23,36.73 | v53.07,23.57 59.38,17.26 J2.4
  Bottom 0.406: v48.34,43.56 48.34,43.22 51.94,39.62 51.94,24.7 v53.07,23.57 | v39.23,36.73 38.55,36.05 37.72,36.05 U1.9
LED2  (via drill 0.51)
  Top 0.406: v48.94,44.66 39.75,44.66 36.74,41.65 36.74,37.22 v35.77,36.25
  Bottom 0.406: v35.77,36.25 36.39,36.87 U1.10 | J3.4 50.54,43.05 v48.94,44.66
LED3  (via drill 0.51)
  Top 0.406: v49.79,36.21 50.21,36.64 v50.21,39.23
  Bottom 0.406: v50.21,39.23 49.78,39.23 48.45,40.56 48.31,40.56 47.21,41.67 U1.25 | v49.79,36.21 49.79,28.75 42.55,21.51 35.81,21.51 31.71,17.41 31.71,17.4 25.17,10.86 22.04,10.86 LED.1
MISO
  Top 0.406: U5.7 29.13,50.42 29.87,49.68 29.87,45.44 29.85,45.42 29.85,42.12 27.82,40.09 J5.1
  Bottom 0.406: U1.16 32.7,46.67 26.98,46.67 26.27,47.38 26.27,48.38 26.98,49.09 27.36,49.09 27.48,49.21 U5.7
MOSI
  Top 0.406: J5.4 24.06,37.48 24.06,39.3 25.57,40.81 25.57,40.83 26.17,41.43 26.17,46.65 U5.6
  Bottom 0.406: U1.15 36.75,40.87 33.49,44.13 26.98,44.13 26.15,44.96 26.15,45.84 24.94,47.05 U5.6
N$1
  Bottom 0.406: Q2.1 34.52,54.65 R12.1
N$2
  Bottom 0.406: D2.A 39.69,55.28 Q2.3 42.07,50.05 K2.A1
N$3
  Bottom 0.406: D1.A 51.38,15.67 Q1.3
  Bottom 1.27: K1.A1 53.42,11.42 D1.A
N$6
  Bottom 0.406: R11.1 47.66,15.14 Q1.1
N$8
  Bottom 0.406: R6.2 23.44,14.21 LED.2
N$9
  Bottom 0.406: J2.3 61.5,18.7 R2.1
N$11
  Bottom 0.406: R4.1 61.69,41.14 J3.3
N$16
  Bottom 0.406: U6.7 26.57,6.08 R10.1
NONE
  cutout Bottom: 30.15,7.84 32.68,7.84 32.7,7.82 32.7,3.24 32.59,3.13 30.1,3.13 30.1,7.76 30.13,7.79
OUT_A
  Top 2.54: J7.2 73.65,22.09 73.65,19.76 65.36,11.47 K1.11-1 K1.11
OUT_B
  Top 2.54: K2.11-1 K2.11
  Bottom 2.54: J8.2 74.3,46.15 69.44,46.15 K2.11
RELAY1  (via drill 0.51)
  Top 0.406: v32.76,19.9 42.62,19.9 v43.46,19.06
  Bottom 0.406: U1.11 35.88,37.67 35.26,37.05 35.25,37.05 34.72,36.52 34.72,36.51 30.35,32.14 27.68,32.14 26.77,31.23 26.77,23.99 30.86,19.9 v32.76,19.9 | v43.46,19.06 43.53,18.99 R11.2
RELAY2  (via drill 0.51)
  Top 0.406: v32.85,51.08 31.71,49.94 31.71,44.95 34.62,42.04 34.62,39.01 v35.27,38.36
  Bottom 0.406: R12.2 33.33,51.56 v32.85,51.08 | v35.27,38.36 35.38,38.47 U1.12
RST  (via drill 0.51)
  Top 0.406: J5.5 21.52,37.58 21.52,35.76 v23.18,34.1 23.22,34.06 45.23,34.06 47.67,36.5 v47.67,38.31
  Bottom 0.406: v23.18,34.1 25.22,34.1 R1.1 | U1.29 47.51,38.47 v47.67,38.31
SCK
  Top 0.406: J5.3 25.66,38.8 29.24,42.38 29.24,46.12 U5.5
  Bottom 0.406: U1.17 37.33,43.16 32.61,47.88 U5.5
SCL
  Bottom 0.406: R8.2 24.64,4.82 U6.6 29.91,4.82 30.55,5.46 30.55,15.36 36.09,20.9 42.83,20.9 50.7,28.77 50.7,36.59 48.02,39.27 47.19,39.27 U1.28
SDA
  Bottom 0.406: R7.2 23.64,3.54 U6.5 30.45,3.54 31.32,4.42 31.32,4.46 31.32,15.23 36.27,20.18 43.01,20.18 51.31,28.48 51.31,36.84 48.2,39.96 46.4,39.96 U1.27
TAB  (via drill 0.51)
  Bottom 0.254: U3.TAB 12.12,32.57 v12.16,32.61 | U3.TAB 11.99,29.95 v11.99,27.54 | U3.TAB 10.22,30.08 v10.08,30.22 | U3.TAB 14.04,30.08 v14.08,30.12
  pour Bottom (no thermals): 15.09,33.35 15.09,26.94 15.02,26.87 9.39,26.87 9.37,26.89 9.37,33.3 9.32,33.35 15.07,33.35 15.08,33.34
  pour Top: 15.11,33.36 15.11,26.95 15.04,26.88 9.41,26.88 9.39,26.9 9.39,33.31 9.34,33.36 15.09,33.36 15.1,33.35
TX_UART  (via drill 0.51)
  Top 0.406: v44.89,36.83 42.74,34.68 29.62,34.68 v29.29,35.01
  Bottom 0.406: U1.31 44.93,36.87 v44.89,36.83 | v29.29,35.01 22.26,35.01 21.52,35.76 21.52,36.47 J6.1
VBAT_3V  (via drill 0.51)
  Top 0.406: BH1.+$1 2.38,7.46 2.38,3.49 5.14,0.73 18.81,0.73 | BH1.+$2 18.76,0.78 18.81,0.73 | v36.62,3.82 33.53,0.73 18.81,0.73
  Bottom 0.406: v36.62,3.82 35.62,4.82 U6.3
VCC  (via drill 0.51)
  Top 1.016: 48.22,46.88 48.22,55.43 46.1,57.55 K2.A2 | 31.49,21.16 45.1,21.16 | 45.1,21.16 45.95,21.16 55.02,30.23 | K1.A2 45.06,21.12 45.1,21.16 | 31.49,21.16 31.49,11.83 v28.84,9.18 | v39.42,46.68 48.02,46.68 48.22,46.88 | 54.59,41.31 54.85,41.05 54.85,30.39 55.02,30.23 | 54.59,41.31 49.02,46.88 48.22,46.88 | 54.59,41.31 54.78,41.31 58.58,45.1 61.83,45.1 63.24,43.69 63.24,43.5 J3.2 | 55.02,30.23 63.5,21.74 J2.2 | v24.74,25.4 27.25,25.4 31.49,21.16
  Bottom 0.406: U1.18 39.99,44.41 C4.1 | U1.4 C5.1 | C5.1 41.49,32.76 v41.13,33.12 | U6.8 27.21,7.36 R10.2 | U1.6 40.79,33.46 v41.13,33.12 | C5.1 41.48,32.77 v41.13,33.12 | C16.1 30.9,2.16 | R1.2 25.02,31.48 25.02,25.78 24.69,25.45 | 18.37,27.72 U3.3
  Bottom 1.016: v28.84,9.18 28.8,9.18 27.66,8.04 R10.2 26.49,8 25.02,8 R8.1 22.09,7.22 R7.1 21.14,7.16 20.11,6.13 20.11,4.51 22.87,1.75 C16.1 | C4.1 39.3,46.56 v39.42,46.68 | K2.A2 41.42,57.55 D2.C | U3.3 21.28,27.77 C10.1 21.33,26.96 22.84,25.45 24.69,25.45 v24.74,25.4
  Bottom 1.27: J9.1 70.57,14.75 64.78,14.75 63.5,16.03 J2.2 | 63.5,16.89 J2.2 | J2.2 63.5,16.04 62.34,14.88 58.67,14.88 D1.C
  pour Top: 76.55,0.71 76.51,0.67 17.09,0.67 17.29,28.78 17.27,28.8 22.8,28.85 22.8,40.11 30.13,40.11 30.23,40.01 30.23,59.87 30.18,59.92 76.55,59.85
VCC3.3  (via drill 0.51)
  Top 1.016: U5.2 22.46,40.32 18.78,40.32 16.17,37.72 v16.17,31.15 16.07,31.05 16.07,23.43 17.97,21.53 C13.2
  Bottom 1.016: U5.2 24.75,42.61 R9.1 22.38,42.55 C12.1 | v16.17,31.15 16.17,31.05 17.14,30.08 U3.2 18.48,30.24 21.42,30.24 C11.1
X1
  Bottom 0.406: U6.1 36.41,7.36 Y2.2 35.27,8.56 C15.1
X2
  Bottom 0.406: U6.2 37.67,6.08 Y2.1 40.58,8.99 C14.1
XTAL1
  Bottom 0.406: U1.7 39.99,29.47 Y1.1 41.41,28.05 C1.1
XTAL2
  Bottom 0.406: U1.8 32.99,28.38 Y1.2 30.64,27.44 C2.1

### Text on the board
tPlace: v1.0 | 5V | GND